# Altium project DD_Current_Sensing.PrjPcb
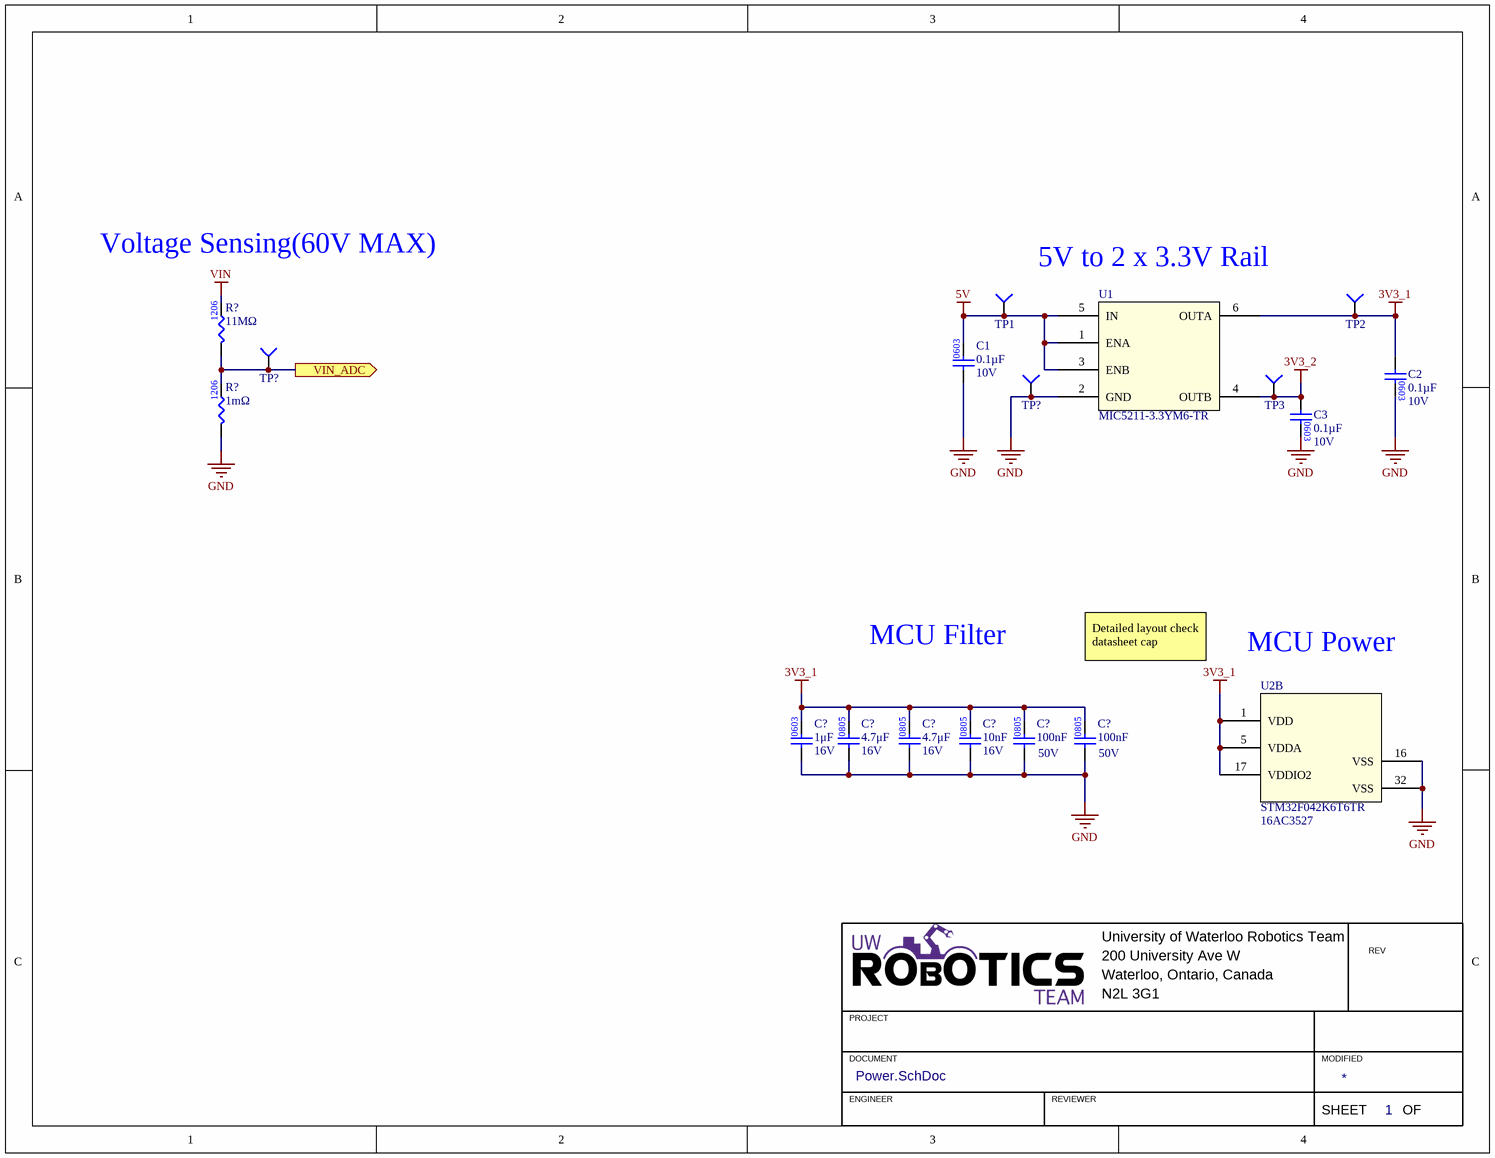
[diagram p0: Power.SchDoc]
designer: Logan Hartford; reviewer: Ari Wasch; total sheets: 6; version: 6.0
2 sheets, 18 parts. Net scope: flat (ports and power ports of the same name join across sheets).
Sheets:
  Power.SchDoc
  MCU.SchDoc

## Sheet Power.SchDoc: =documentname
size 279 x 215 mm; CheckedBy: TBD; Engineer: Yuchen Lin; Organization: UW Robotics; Address1: 200 University Avenue; Address2: Waterloo; Address3: Ontario; Address4: Canada N2L 3G6; DocumentNumber: 1; Revision: 1.0; SheetNumber: 1; SheetTotal: 2; designer: Yuchen Lin; reviewer: TBD; total sheets: 2; version: 1.0

### Parts
(Parts that share a designator on the sheet are numbered #1, #2 ... from top to bottom, then left to right.)
C1  value 0.1µF  Voltage Rating: 10V  [CAP0603]  (hidden comment: CAP_0.1uF_10V_0603)
C2  value 0.1µF  Voltage Rating: 10V  [CAP0603]  (hidden comment: CAP_0.1uF_10V_0603)
C3  value 0.1µF  Voltage Rating: 10V  [CAP0603]  (hidden comment: CAP_0.1uF_10V_0603)
C?#1  value 1μF  Voltage Rating: 16V  [CAP0603]  (hidden comment: CAP_1uF_16V_0603)
C?#2  value 4.7μF  Voltage Rating: 16V  [CAP0805]  (hidden comment: CAP_4.7uF_16V_0805)
C?#3  value 4.7μF  Voltage Rating: 16V  [CAP0805]  (hidden comment: CAP_4.7uF_16V_0805)
C?#4  value 10nF  Voltage Rating: 16V  [CAP0805]  (hidden comment: CAP_10nF_16V_0805)
C?#5  value 100nF  Voltage Rating: 50V  [CAP0805]  (hidden comment: CAP_100nF_50V_0805)
C?#6  value 100nF  Voltage Rating: 50V  [CAP0805]  (hidden comment: CAP_100nF_50V_0805)
R?#1  value 11MΩ  [RESC3116X65N]  (hidden comment: RES_11MΩ_1206_1%)
R?#2  value 1mΩ  [RESC3116X65N]  (hidden comment: RES_1mΩ_1206_1%)
TP1  TESTPOINT_SMD_LOOP  [S1751-46R]  (value not drawn)
TP2  TESTPOINT_SMD_LOOP  [S1751-46R]  (value not drawn)
TP3  TESTPOINT_SMD_LOOP  [S1751-46R]  (value not drawn)
TP?#1  TESTPOINT_SMD_LOOP  [S1751-46R]  (value not drawn)
TP?#2  TESTPOINT_SMD_LOOP  [S1751-46R]  (value not drawn)
U1  MIC5211-3.3YM6-TR  [SOT-23-6_M6_MCH]
U2  STM32F042K6T6TR  Supplier Part Number 1: 16AC3527  [LQFP-32]  (part B of 2)

### Ports
VIN_ADC (out)

### Nets
3V3_1: C2.1 C?#1.2 C?#2.2 C?#3.2 C?#4.2 C?#5.2 C?#6.2 TP2.1(=value) U1.6(OUTA) U2.1(VDD) U2.5(VDDA) U2.17(VDDIO2)
3V3_2: C3.1 TP3.1(=value) U1.4(OUTB)
5V: C1.2 TP1.1(=value) U1.1(ENA) U1.3(ENB) U1.5(IN)
GND: C1.1 C2.2 C3.2 C?#1.1 C?#2.1 C?#3.1 C?#4.1 C?#5.1 C?#6.1 R?#2.1 TP?#2.1(=value) U1.2(GND) U2.16(VSS) U2.32(VSS)
VIN: R?#1.2
NetR?#1_1: R?#1.1 R?#2.2 TP?#1.1(=value) ; port VIN_ADC

### Notes on the sheet
- Voltage Sensing(60V MAX)
- 5V to 2 x 3.3V Rail
- MCU Filter
- Detailed layout check datasheet cap
- MCU Power
- University of Waterloo Robotics Team
- 200 University Ave W
- REV
- PROJECT
- Waterloo, Ontario, Canada
- N2L 3G1
- DOCUMENT
- ENGINEER
- REVIEWER
- MODIFIED
- SHEET
- OF
- (in symbol CAP_0.1uF_10V_0603) 0603
- (in symbol CAP_10nF_16V_0805) 0805

### Library data of the parts
C1-C3 = CAP_0.1uF_10V_0603: CAP CER 0.1UF 10V X7R 0402; Manufacturer 1: Murata Electronics; Manufacturer Part Number 1: GRM155R71A104KA01D; Package/Footprint: 0402; Supplier 1: Digi-Key; Supplier Part Number 1: 490-6321-1-ND
C?#1 = CAP_1uF_16V_0603: CAP CER 1UF 16V Y5V 0603; Manufacturer 1: Yageo; Manufacturer Part Number 1: CC0603ZRY5V7BB105; Supplier Part Number 1: 311-1372-1-ND; Supplier 1: Digi-Key; Mounting Type: SMD; Package: 0603; Dielectric: Y5V
C?#2 C?#3 = CAP_4.7uF_16V_0805: CAP CER 4.7UF 16V X5R 0805; Manufacturer 1: Samsung Electro-Mechanics; Manufacturer Part Number 1: CL21A475KOFNNNE; Mounting Type: SMD; Supplier 1: Digi-Key; Supplier Part Number 1: 1276-1065-1-ND; Package: 0805; LCSC Part #: C1779; Dielectric: X5R
C?#4 = CAP_10nF_16V_0805: CAP CER 10000PF 16V X7R 0805; Manufacturer 1: Yageo; Manufacturer Part Number 1: AC0805KRX7R7BB103; Supplier 1: Digi-Key; Supplier Part Number 1: 311-3161-1-ND
C?#5 C?#6 = CAP_100nF_50V_0805: CAP CER 0.1UF 50V X7R 0805; Manufacturer 1: Samsung Electro-Mechanics; Manufacturer Part Number 1: CL21B104KBCNNNC; Package/Footprint: 0805; Supplier 1: Digi-Key; Supplier Part Number 1: 1276-1003-1-ND
R?#1 = RES_11MΩ_1206_1%: 11 MOhms ±1% 0.25W, 1/4W Chip Resistor 1206 (3216 Metric) High Voltage, Moisture Resistant Thick Film; Manufacturer 1: YAGEO; Manufacturer Part Number 1: RV1206FR-0711ML; Package/Footprint: 1206; Mounting Type: SMD; ComponentLink1Description: digikey; ComponentLink1URL: https://www.digikey.ca/en/products/detail/yageo/RV1206FR-0711ML/17026349; Supplier 1: DigiKey; Supplier Part Number 1: 13-RV1206FR-0711MLCT-ND
R?#2 = RES_1mΩ_1206_1%: RES 0.001 OHM 1% 1W 1206; Manufacturer 1: Delta Electronics/Cyntec; Manufacturer Part Number 1: RL1632T4F-R001-FNH; Package/Footprint: 1206; Mounting Type: SMD; Supplier 1: Digi-Key; Supplier Part Number 1: 2037-RL1632T4F-R001-FNHCT-ND
TP1-TP3 TP?#1 TP?#2 = TESTPOINT_SMD_LOOP: TESTPOINT SMD LOOP; Manufacturer 1: Harwin; Supplier 1: Digi-Key; Manufacturer Part Number 1: S1751-46R; Mounting Type: SMD; Package/Footprint: SMD; Supplier Part Number 1: 952-1478-1-ND
U1 = MIC5211-3.3YM6-TR: Linear Voltage Regulator IC Positive Fixed 2 Output 80mA, 80mA SOT-23-6; Mfr_Name: Microchip; Voltage - Input (Max): 16; Output Type: 3.3V; Package / Case: SOT-23-6; ComponentLink1Description: digikey; ComponentLink1URL: https://www.digikey.ca/en/products/detail/microchip-technology/MIC5211-3-3YM6-TR/1616942
U2 = STM32F042K6T6TR: ARM® Cortex®-M0 STM32F0 Microcontroller IC 32-Bit Single-Core 48MHz 32KB (32K x 8) FLASH 32-LQFP (7x7); Mfr_Name: STMicroelectronics; Voltage - Supply (Vcc/Vdd): 2V ~ 3.6V; Core Processor: ARM® Cortex®-M0; Core Size: 32-Bit Single-Core; Speed: 48MHz; Program Memory Size: 32KB (32K x 8); Operating Temperature: -40°C ~ 85°C (TA); Package / Case: 32-LQFP; ComponentLink1Description: digikey; ComponentLink1URL: https://www.digikey.com/en/products/detail/stmicroelectronics/STM32F042K6T6TR/10414582; Supplier 1: Avnet

## Sheet MCU.SchDoc: MCU.SchDoc
size 279 x 215 mm
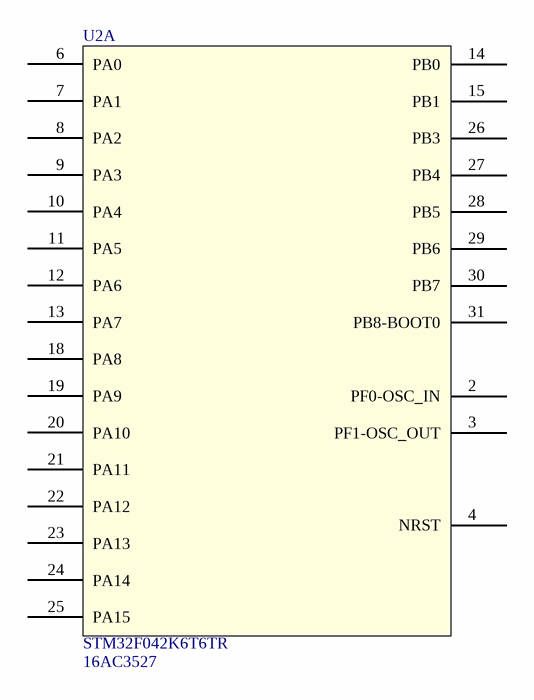
[diagram p1: MCU.SchDoc]

### Parts
U2  STM32F042K6T6TR  Supplier Part Number 1: 16AC3527  [LQFP-32]  (part A of 2)

### Nets

Not connected (* = marked no-connect by the designer): U2 2(PF0-OSC_IN) 3(PF1-OSC_OUT) 4(NRST) 6(PA0) 7(PA1) 8(PA2) 9(PA3) 10(PA4) 11(PA5) 12(PA6) 13(PA7) 14(PB0) 15(PB1) 18(PA8) 19(PA9) 20(PA10) 21(PA11) 22(PA12) 23(PA13) 24(PA14) 25(PA15) 26(PB3) 27(PB4) 28(PB5) 29(PB6) 30(PB7) 31(PB8-BOOT0)

### Notes on the sheet
- University of Waterloo Robotics Team
- 200 University Ave W
- REV
- PROJECT
- Waterloo, Ontario, Canada
- N2L 3G1
- DOCUMENT
- ENGINEER
- REVIEWER
- MODIFIED
- SHEET
- OF

### Library data of the parts
U2 = STM32F042K6T6TR: as U2 on sheet Power; Core Processor: ARM® Cortex®-M0; Core Size: 32-Bit Single-Core; Speed: 48MHz; Program Memory Size: 32KB (32K x 8); Operating Temperature: -40°C ~ 85°C (TA); Package / Case: 32-LQFP; ComponentLink1Description: digikey; ComponentLink1URL: https://www.digikey.com/en/products/detail/stmicroelectronics/STM32F042K6T6TR/10414582; Supplier 1: Avnet

## Assembly variants
Only Populated Components: not fitted R28 R31 R44 R47 R60 R77